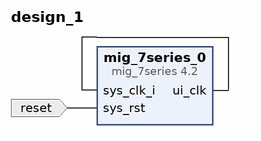
[diagram p0: block diagram of the top level]
# Vivado block design design_1, xc7a200tsbg484-1, Vivado 2020.2
create_bd_design design_1

create_bd_port -dir I -type rst reset
set_property -dict {CONFIG.POLARITY ACTIVE_LOW} [get_bd_ports reset]

create_bd_cell -type ip -vlnv xilinx.com:ip:mig_7series:4.2 mig_7series_0
set_property -dict {CONFIG.RESET_BOARD_INTERFACE reset} [get_bd_cells mig_7series_0]

# ---- connections ----

connect_bd_net [get_bd_pins mig_7series_0/ui_clk] [get_bd_pins mig_7series_0/sys_clk_i]
connect_bd_net [get_bd_ports reset] [get_bd_pins mig_7series_0/sys_rst]

validate_bd_design
save_bd_design
